# Altium schematic sheet FPGA_G.SchDoc: FIT_PM12 board
size 420 x 297 mm; CheckedBy: G.Kasprowicz; Author: INR Moscow; CompanyName: WUT ISE; DrawnBy: M.Podgórski; Organization: WUT ISE; Address1: PW ISE; Address2: Nowowiejska 15/19 00-665 Warsaw; Address3: gkasprow@gmail.com; DocumentNumber: 33; Revision: 2; SheetNumber: 33; SheetTotal: 34; ModifiedBy: -; CheckedDate: -; Title2: FPGA G TDC2; DivGrp: WUT ISE; Designer: INR RAS; ModifiedDate: -; ProjectName: Sensor Box
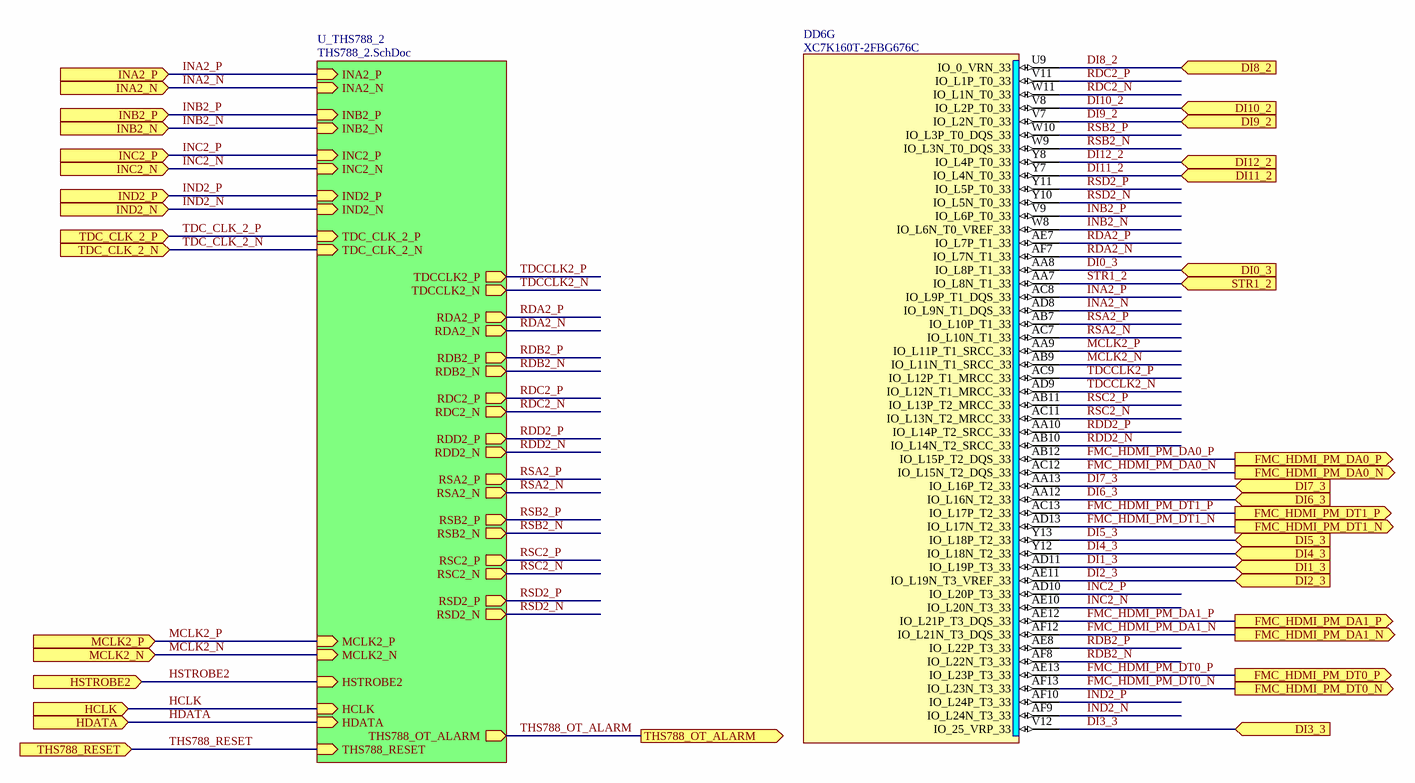
[diagram p0: FPGA_G.SchDoc]

## Parts
DD6  XC7K160T-2FBG676C  [BGA676C100P26X26_2700X2700X254]  (part G of 15)

## Sub-sheets
U_THS788_2 = THS788_2.SchDoc: INC2_P (in), INC2_N (in), IND2_N (in), IND2_P (in), RDD2_P (out), RDD2_N (out), RSD2_P (out), RSD2_N (out), HDATA (in), HCLK (in), HSTROBE2 (in), TDCCLK2_P (out), TDCCLK2_N (out), RSB2_P (out), RSB2_N (out), RDB2_P (out), RDB2_N (out), THS788_OT_ALARM (out), THS788_RESET (in), MCLK2_N (in), MCLK2_P (in), INB2_N (in), INB2_P (in), TDC_CLK_2_P (in), TDC_CLK_2_N (in), INA2_P (in), INA2_N (in), RDA2_N (out), RDA2_P (out), RSA2_P (out), RSA2_N (out), RSC2_N (out), RSC2_P (out), RDC2_N (out), RDC2_P (out)

## Ports
DI0_3 (in), DI1_3 (in), DI2_3 (in), DI3_3 (in), DI4_3 (in), DI5_3 (in), DI6_3 (in), DI7_3 (in), DI8_2 (in), DI9_2 (in), DI10_2 (in), DI11_2 (in), DI12_2 (in), FMC_HDMI_PM_DA0_N (out), FMC_HDMI_PM_DA0_P (out), FMC_HDMI_PM_DA1_N (out), FMC_HDMI_PM_DA1_P (out), FMC_HDMI_PM_DT0_N (out), FMC_HDMI_PM_DT0_P (out), FMC_HDMI_PM_DT1_N (out), FMC_HDMI_PM_DT1_P (out), HCLK (in), HDATA (in), HSTROBE2 (in), INA2_N (in), INA2_P (in), INB2_N (in), INB2_P (in), INC2_N (in), INC2_P (in), IND2_N (in), IND2_P (in), MCLK2_N (in), MCLK2_P (in), STR1_2 (in), TDC_CLK_2_N (in), TDC_CLK_2_P (in), THS788_OT_ALARM (out), THS788_RESET (in)

## Nets
DI0_3: DD6.AA8(IO_L8P_T1_33) ; port DI0_3
DI1_3: DD6.AD11(IO_L19P_T3_33) ; port DI1_3
DI2_3: DD6.AE11(IO_L19N_T3_VREF_33) ; port DI2_3
DI3_3: DD6.V12(IO_25_VRP_33) ; port DI3_3
DI4_3: DD6.Y12(IO_L18N_T2_33) ; port DI4_3
DI5_3: DD6.Y13(IO_L18P_T2_33) ; port DI5_3
DI6_3: DD6.AA12(IO_L16N_T2_33) ; port DI6_3
DI7_3: DD6.AA13(IO_L16P_T2_33) ; port DI7_3
DI8_2: DD6.U9(IO_0_VRN_33) ; port DI8_2
DI9_2: DD6.V7(IO_L2N_T0_33) ; port DI9_2
DI10_2: DD6.V8(IO_L2P_T0_33) ; port DI10_2
DI11_2: DD6.Y7(IO_L4N_T0_33) ; port DI11_2
DI12_2: DD6.Y8(IO_L4P_T0_33) ; port DI12_2
FMC_HDMI_PM_DA0_N: DD6.AC12(IO_L15N_T2_DQS_33) ; port FMC_HDMI_PM_DA0_N
FMC_HDMI_PM_DA0_P: DD6.AB12(IO_L15P_T2_DQS_33) ; port FMC_HDMI_PM_DA0_P
FMC_HDMI_PM_DA1_N: DD6.AF12(IO_L21N_T3_DQS_33) ; port FMC_HDMI_PM_DA1_N
FMC_HDMI_PM_DA1_P: DD6.AE12(IO_L21P_T3_DQS_33) ; port FMC_HDMI_PM_DA1_P
FMC_HDMI_PM_DT0_N: DD6.AF13(IO_L23N_T3_33) ; port FMC_HDMI_PM_DT0_N
FMC_HDMI_PM_DT0_P: DD6.AE13(IO_L23P_T3_33) ; port FMC_HDMI_PM_DT0_P
FMC_HDMI_PM_DT1_N: DD6.AD13(IO_L17N_T2_33) ; port FMC_HDMI_PM_DT1_N
FMC_HDMI_PM_DT1_P: DD6.AC13(IO_L17P_T2_33) ; port FMC_HDMI_PM_DT1_P
HCLK: port HCLK, sheet U_THS788_2/HCLK
HDATA: port HDATA, sheet U_THS788_2/HDATA
HSTROBE2: port HSTROBE2, sheet U_THS788_2/HSTROBE2
INA2_N: DD6.AD8(IO_L9N_T1_DQS_33) ; port INA2_N, sheet U_THS788_2/INA2_N
INA2_P: DD6.AC8(IO_L9P_T1_DQS_33) ; port INA2_P, sheet U_THS788_2/INA2_P
INB2_N: DD6.W8(IO_L6N_T0_VREF_33) ; port INB2_N, sheet U_THS788_2/INB2_N
INB2_P: DD6.V9(IO_L6P_T0_33) ; port INB2_P, sheet U_THS788_2/INB2_P
INC2_N: DD6.AE10(IO_L20N_T3_33) ; port INC2_N, sheet U_THS788_2/INC2_N
INC2_P: DD6.AD10(IO_L20P_T3_33) ; port INC2_P, sheet U_THS788_2/INC2_P
IND2_N: DD6.AF9(IO_L24N_T3_33) ; port IND2_N, sheet U_THS788_2/IND2_N
IND2_P: DD6.AF10(IO_L24P_T3_33) ; port IND2_P, sheet U_THS788_2/IND2_P
MCLK2_N: DD6.AB9(IO_L11N_T1_SRCC_33) ; port MCLK2_N, sheet U_THS788_2/MCLK2_N
MCLK2_P: DD6.AA9(IO_L11P_T1_SRCC_33) ; port MCLK2_P, sheet U_THS788_2/MCLK2_P
RDA2_N: DD6.AF7(IO_L7N_T1_33) ; sheet U_THS788_2/RDA2_N
RDA2_P: DD6.AE7(IO_L7P_T1_33) ; sheet U_THS788_2/RDA2_P
RDB2_N: DD6.AF8(IO_L22N_T3_33) ; sheet U_THS788_2/RDB2_N
RDB2_P: DD6.AE8(IO_L22P_T3_33) ; sheet U_THS788_2/RDB2_P
RDC2_N: DD6.W11(IO_L1N_T0_33) ; sheet U_THS788_2/RDC2_N
RDC2_P: DD6.V11(IO_L1P_T0_33) ; sheet U_THS788_2/RDC2_P
RDD2_N: DD6.AB10(IO_L14N_T2_SRCC_33) ; sheet U_THS788_2/RDD2_N
RDD2_P: DD6.AA10(IO_L14P_T2_SRCC_33) ; sheet U_THS788_2/RDD2_P
RSA2_N: DD6.AC7(IO_L10N_T1_33) ; sheet U_THS788_2/RSA2_N
RSA2_P: DD6.AB7(IO_L10P_T1_33) ; sheet U_THS788_2/RSA2_P
RSB2_N: DD6.W9(IO_L3N_T0_DQS_33) ; sheet U_THS788_2/RSB2_N
RSB2_P: DD6.W10(IO_L3P_T0_DQS_33) ; sheet U_THS788_2/RSB2_P
RSC2_N: DD6.AC11(IO_L13N_T2_MRCC_33) ; sheet U_THS788_2/RSC2_N
RSC2_P: DD6.AB11(IO_L13P_T2_MRCC_33) ; sheet U_THS788_2/RSC2_P
RSD2_N: DD6.Y10(IO_L5N_T0_33) ; sheet U_THS788_2/RSD2_N
RSD2_P: DD6.Y11(IO_L5P_T0_33) ; sheet U_THS788_2/RSD2_P
STR1_2: DD6.AA7(IO_L8N_T1_33) ; port STR1_2
TDC_CLK_2_N: port TDC_CLK_2_N, sheet U_THS788_2/TDC_CLK_2_N
TDC_CLK_2_P: port TDC_CLK_2_P, sheet U_THS788_2/TDC_CLK_2_P
TDCCLK2_N: DD6.AD9(IO_L12N_T1_MRCC_33) ; sheet U_THS788_2/TDCCLK2_N
TDCCLK2_P: DD6.AC9(IO_L12P_T1_MRCC_33) ; sheet U_THS788_2/TDCCLK2_P
THS788_OT_ALARM: port THS788_OT_ALARM, sheet U_THS788_2/THS788_OT_ALARM
THS788_RESET: port THS788_RESET, sheet U_THS788_2/THS788_RESET

## Notes on the sheet
- Project/Equipment
- Document
- Designer
- Drawn by
- Check.by
- Copyright WUT ISE 2024.
  This documentation describes Open Hardware and is licensed under the CERN OHL v.2. You may redistribute and modify this documentation under the terms of the CERN OHL v.2. (http://ohwr.org/CERNOHL). This documentation is distributed WITHOUT ANY EXPRESS OR IMPLIED WARRANTY, INCLUDING OF MERCHANTABILITY, SATISFACTORY QUALITY AND FITNESS FOR A PARTICULAR PURPOSE. Please see the CERN OHL v.2 for applicable conditions.
- Contact
- File
- Last Mod.
- Print Date
- Sheet
- Size
- A3
- of
- Rev

## Library data of the parts
DD6 = XC7K160T-2FBG676C: KINTEX-7, FPGA, 676-Ball BGA, Pb-Free; Part Description: KINTEX-7 FPGA, 162240 Logic Cells, 400 User I/O, 8 GTXs, 676-Ball BGA, Speed Grade 2, Commercial Grade, Pb-Free; Manufacturer: XILINX; PressFit: No; Bonding: No; Part Number: XC7K160T-2FBG676C; Component Kind: Standard; Component Type: Standard; Device: XC7K160T-2FBG676C; PackageDescription: BGA, 1.00mm Pitch, Square; 676 Pin, 26 Columns X 26 Rows, Body 27.0mm X 27.0mm X 2.54mm H, IPC Medium Density; Manufacturer Part Number: XC7K160T-2FBG676C; Pin Count: 676; Case: BGA676; Mounted: Yes; Socket: No; SMD: Yes; Sense: No; ComponentHeight: 2.54mm; HelpURL: \\cern.ch\dfs\Applications\Altium\Datasheets\XC7K160T-xFBG676C.pdf; ComponentLink1URL: \\cern.ch\dfs\Applications\Altium\Datasheets\XC7K160T-xFBG676C_Package-Pinout.pdf; ComponentLink1Description: Package/Pinout; Author: CERN DEM BC; CreateDate: 06.02.2020; LatestRevisionDate: 06.02.2020